# EasyEDA schematic IN OUT+ BIT 7.json
TITLE: TRICORE | ALU | CMP; REV: 1.0; Date: 2022-01-04; Sheet: 1/8; Drawn By: Koehler, Paul; Company: komed3
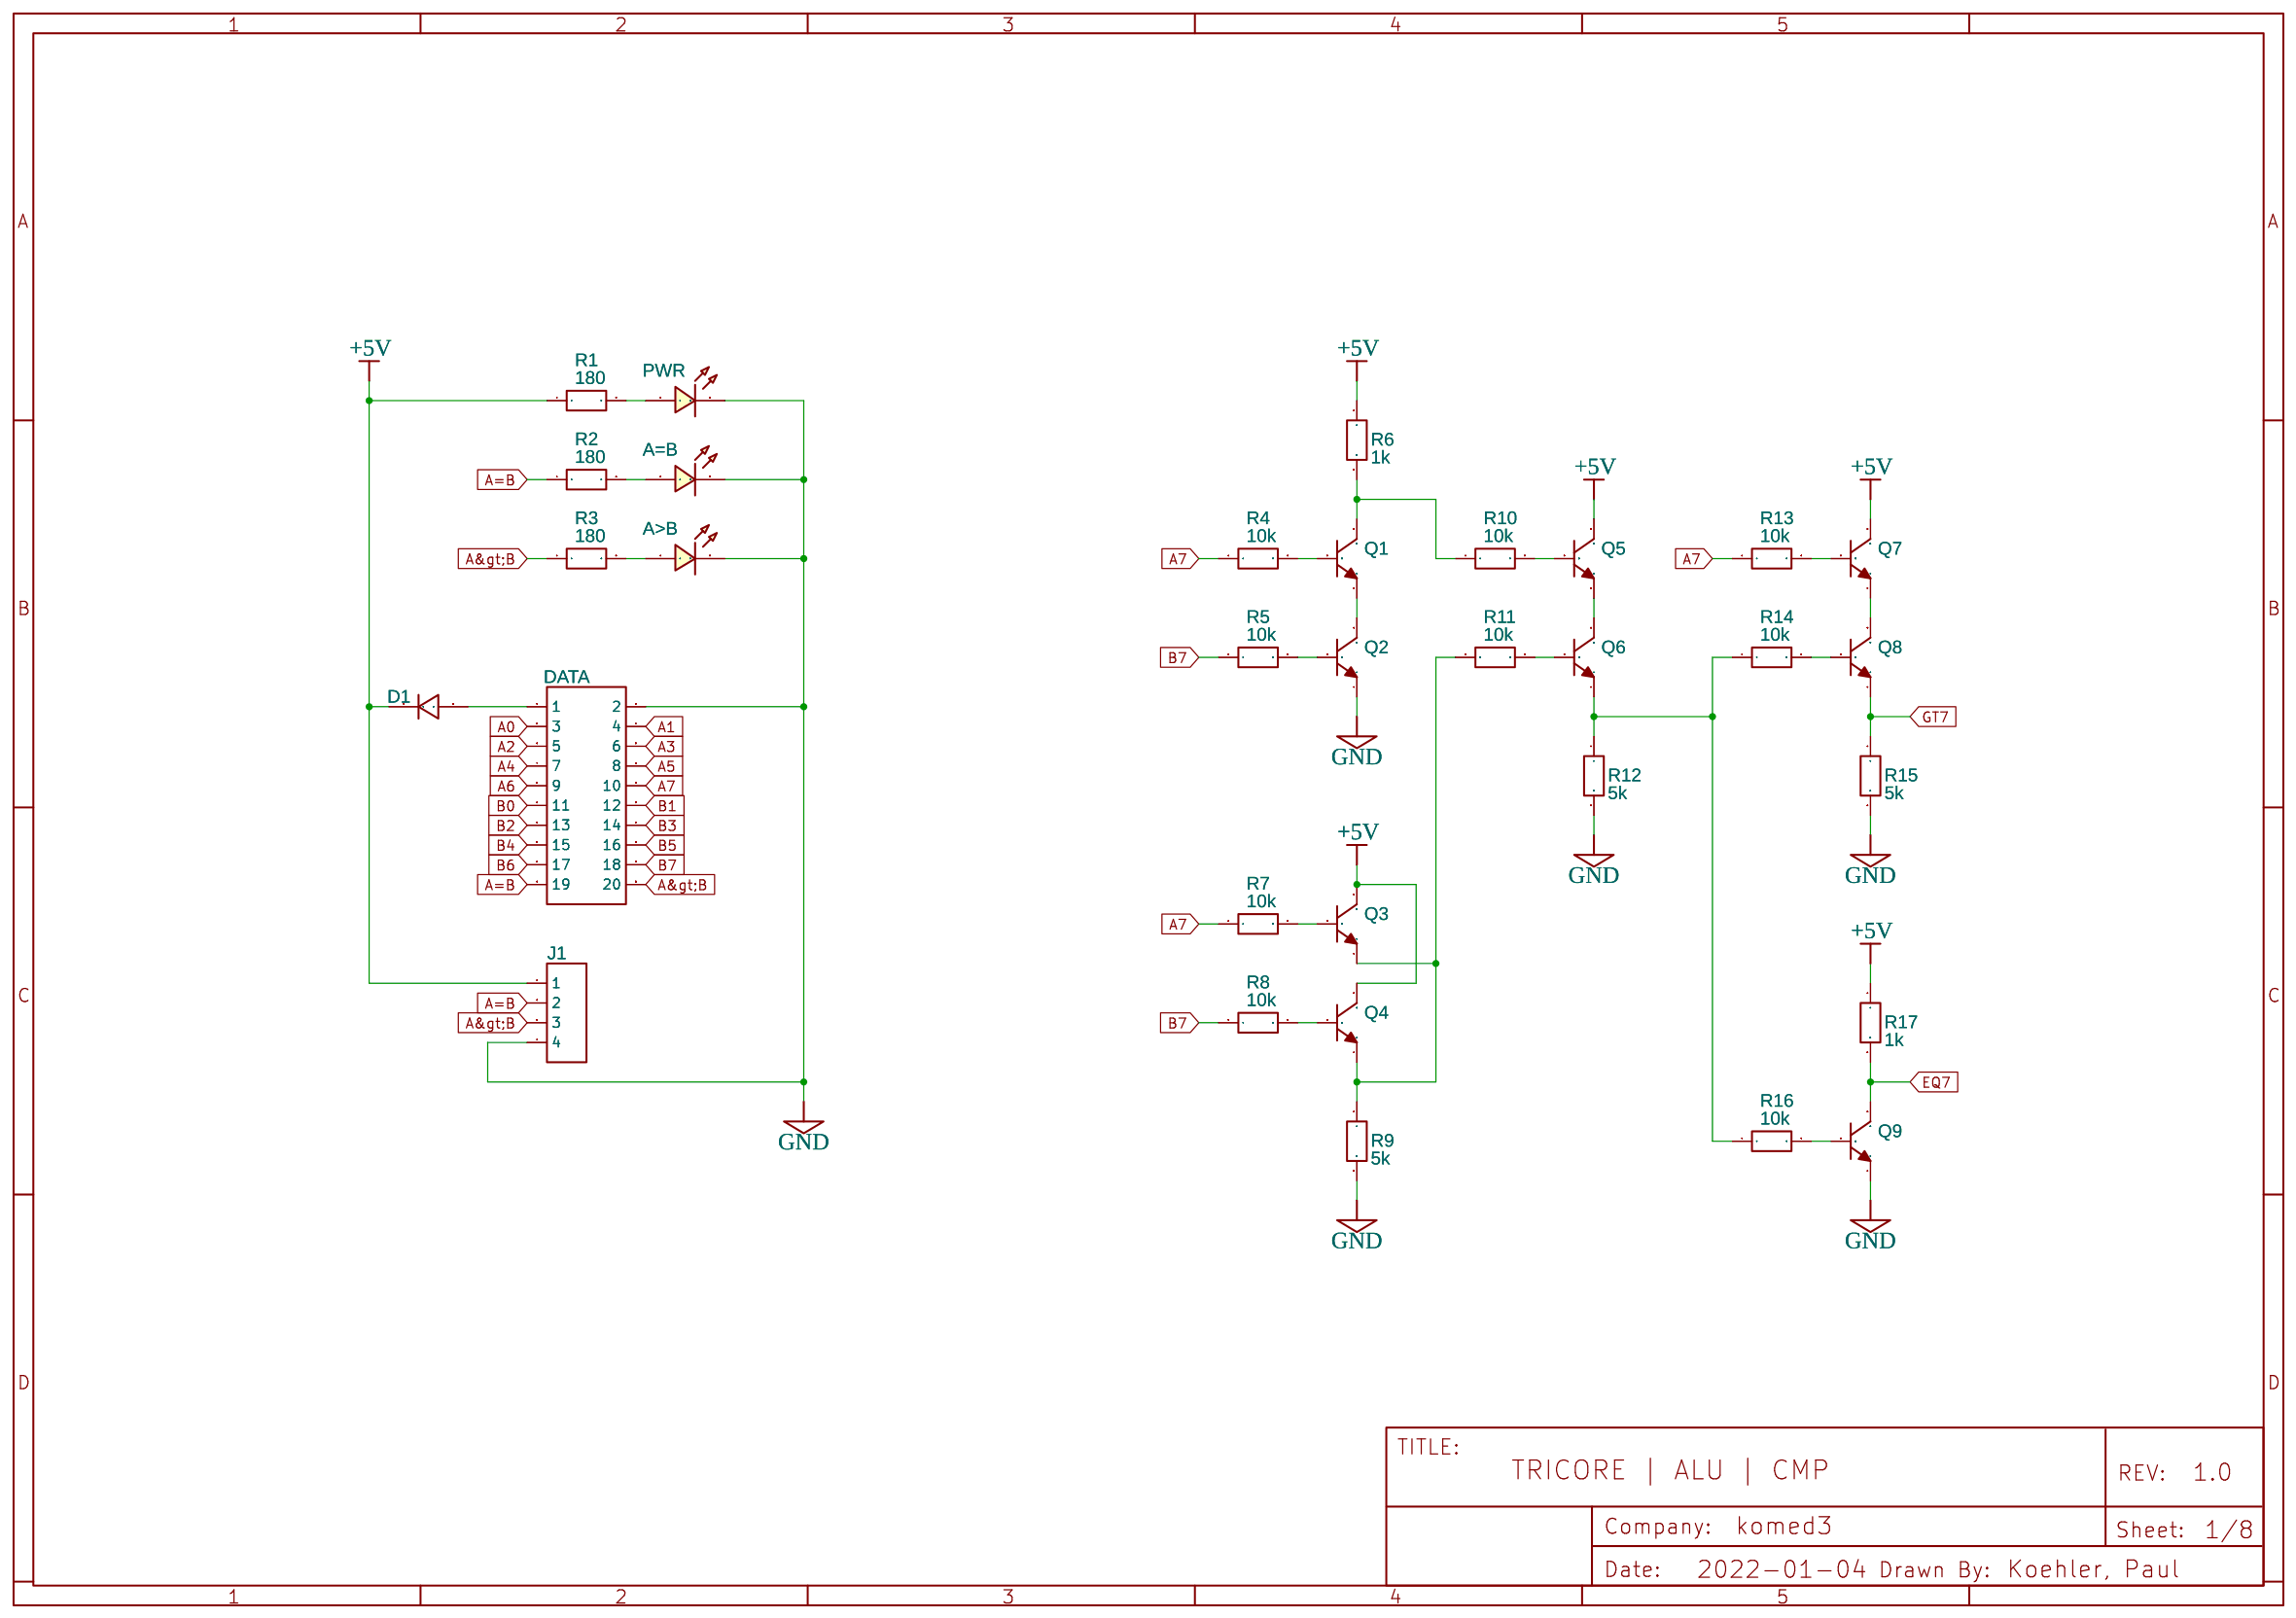
[diagram p0: schematic sheet]

## Parts
A=B  LED-TH-5mm_R  [LED-TH_BD5.0_RED]
A>B  LED-TH-5mm_R  [LED-TH_BD5.0_RED]
D1  1N4007  [DO-41_BD2.4-L4.7-P8.70-D0.9-RD]
DATA  HDR-IDC-2.54-2X10P  [IDC-TH_20P-P2.54-V-R2-C10-S2.54]
J1  HDR-M-2.54_1x4  [HDR-M-2.54_1X4]
PWR  LED-TH-5mm_R  [LED-TH_BD5.0_RED]
Q1  2N3904(TO-92)  [TO-92-3_L5.1-W4.1-P1.27-L]
Q2  2N3904(TO-92)  [TO-92-3_L5.1-W4.1-P1.27-L]
Q3  2N3904(TO-92)  [TO-92-3_L5.1-W4.1-P1.27-L]
Q4  2N3904(TO-92)  [TO-92-3_L5.1-W4.1-P1.27-L]
Q5  2N3904(TO-92)  [TO-92-3_L5.1-W4.1-P1.27-L]
Q6  2N3904(TO-92)  [TO-92-3_L5.1-W4.1-P1.27-L]
Q7  2N3904(TO-92)  [TO-92-3_L5.1-W4.1-P1.27-L]
Q8  2N3904(TO-92)  [TO-92-3_L5.1-W4.1-P1.27-L]
Q9  2N3904(TO-92)  [TO-92-3_L5.1-W4.1-P1.27-L]
R1  180  [R_AXIAL-0.3]
R2  180  [R_AXIAL-0.3]
R3  180  [R_AXIAL-0.3]
R4  10k  [R_AXIAL-0.3]
R5  10k  [R_AXIAL-0.3]
R6  1k  [R_AXIAL-0.3]
R7  10k  [R_AXIAL-0.3]
R8  10k  [R_AXIAL-0.3]
R9  5k  [R_AXIAL-0.3]
R10  10k  [R_AXIAL-0.3]
R11  10k  [R_AXIAL-0.3]
R12  5k  [R_AXIAL-0.3]
R13  10k  [R_AXIAL-0.3]
R14  10k  [R_AXIAL-0.3]
R15  5k  [R_AXIAL-0.3]
R16  10k  [R_AXIAL-0.3]
R17  1k  [R_AXIAL-0.3]

## Library data of the parts
A=B A>B PWR = LED-TH-5mm_R: Manufacturer: EVERLIGHT(台湾亿光); Manufacturer Part: 333-2SURD/S530-A3; Supplier Part: C87271; Supplier: LCSC; Contributor: LCEDA_Lib
D1 = 1N4007: Supplier: LCSC; Manufacturer: SEMTECH; Supplier Part: C106903; Contributor: LCEDA_Lib
DATA = HDR-IDC-2.54-2X10P: Supplier: LCSC; Manufacturer: BOOMELE; Manufacturer Part: IDC Box 2.54mm 2X10P　Straight; image: //image.lceda.cn/szlcsc/C3405.jpg; Supplier Part: C3405
J1 = HDR-M-2.54_1x4: Supplier Part: C124378; Supplier: LCSC; Contributor: LCEDA_Lib
Q1-Q9 = 2N3904(TO-92): Supplier: LCSC; Manufacturer: SEMTECH; Manufacturer Part: 2N3904; Supplier Part: C118538; Contributor: LCEDA_Lib
R1-R17 = R_AXIAL-0.3_EU: Contributor: LCEDA_Lib

## Nets
+5V: D1.1 J1.1 Q3.3(C) Q4.3(C) Q5.3(C) Q7.3(C) R1.1 R6.1 R17.1
GND: A=B.2 A>B.2 DATA.2 J1.4 PWR.2 Q2.1(E) Q9.1(E) R9.2 R12.2 R15.2
A0: DATA.3
A1: DATA.4
A2: DATA.5
A3: DATA.6
A4: DATA.7
A5: DATA.8
A6: DATA.9
A7: DATA.10 R4.1 R7.1 R13.1
A>B: DATA.20 J1.3 R3.1
A=B: DATA.19 J1.2 R2.1
B0: DATA.11
B1: DATA.12
B2: DATA.13
B3: DATA.14
B4: DATA.15
B5: DATA.16
B6: DATA.17
B7: DATA.18 R5.1 R8.1
EQ7: Q9.3(C) R17.2
GT7: Q8.1(E) R15.1
Net-(A=B-1): A=B.1 R2.2
Net-(A>B-1): A>B.1 R3.2
Net-(D1-2): D1.2 DATA.1
Net-(PWR-1): PWR.1 R1.2
Net-(Q1-1): Q1.1(E) Q2.3(C)
Net-(Q1-2): Q1.2(B) R4.2
Net-(Q1-3): Q1.3(C) R6.2 R10.1
Net-(Q2-2): Q2.2(B) R5.2
Net-(Q3-1): Q3.1(E) Q4.1(E) R9.1 R11.1
Net-(Q3-2): Q3.2(B) R7.2
Net-(Q4-2): Q4.2(B) R8.2
Net-(Q5-1): Q5.1(E) Q6.3(C)
Net-(Q5-2): Q5.2(B) R10.2
Net-(Q6-1): Q6.1(E) R12.1 R14.1 R16.1
Net-(Q6-2): Q6.2(B) R11.2
Net-(Q7-1): Q7.1(E) Q8.3(C)
Net-(Q7-2): Q7.2(B) R13.2
Net-(Q8-2): Q8.2(B) R14.2
Net-(Q9-2): Q9.2(B) R16.2
